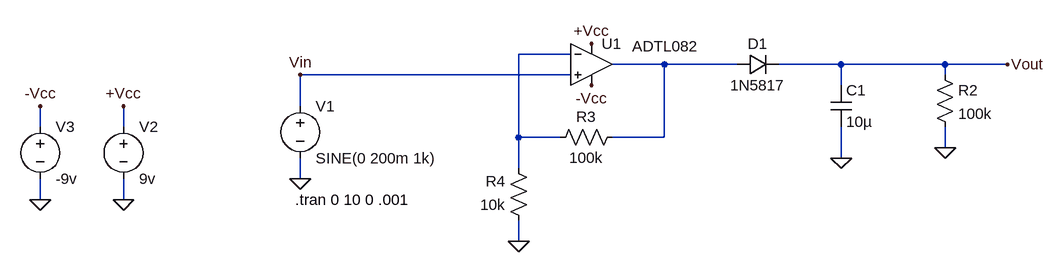
[diagram p0: schematic AudioToArduino.asc]
AudioToArduino.asc, the LTspice schematic file:
Version 4.1
SHEET 1 880 680
WIRE -48 64 -128 64
WIRE 96 80 16 80
WIRE 208 80 96 80
WIRE 368 80 272 80
WIRE 528 80 368 80
WIRE 624 80 528 80
WIRE -48 96 -464 96
WIRE 528 96 528 80
WIRE 368 112 368 80
WIRE -464 144 -464 96
WIRE -864 176 -864 144
WIRE -736 176 -736 144
WIRE -128 192 -128 64
WIRE -64 192 -128 192
WIRE 96 192 96 80
WIRE 96 192 16 192
WIRE 528 208 528 176
WIRE 368 224 368 176
WIRE -128 240 -128 192
WIRE -464 256 -464 224
WIRE -864 288 -864 256
WIRE -736 288 -736 256
WIRE -128 352 -128 320
FLAG -464 256 0
FLAG 528 208 0
FLAG 624 80 Vout
FLAG -464 96 Vin
FLAG 368 224 0
FLAG -128 352 0
FLAG -736 288 0
FLAG -864 288 0
FLAG -736 144 +Vcc
FLAG -864 144 -Vcc
FLAG -16 48 +Vcc
FLAG -16 112 -Vcc
SYMBOL voltage -464 128 R0
WINDOW 123 0 0 Left 0
WINDOW 39 0 0 Left 0
SYMATTR InstName V1
SYMATTR Value SINE(0 200m 1k)
SYMBOL cap 352 112 R0
SYMATTR InstName C1
SYMATTR Value 10µ
SYMBOL res 512 80 R0
SYMATTR InstName R2
SYMATTR Value 100k
SYMBOL diode 208 96 R270
WINDOW 0 32 32 VTop 2
WINDOW 3 0 32 VBottom 2
SYMATTR InstName D1
SYMATTR Value 1N5817
SYMATTR Description Diode
SYMATTR Type diode
SYMBOL OpAmps\\ADTL082 -16 16 R0
WINDOW 3 63 36 Left 2
SYMATTR InstName U1
SYMBOL res 32 176 R90
WINDOW 0 0 56 VBottom 2
WINDOW 3 32 56 VTop 2
SYMATTR InstName R3
SYMATTR Value 100k
SYMBOL res -112 336 R180
WINDOW 0 36 76 Left 2
WINDOW 3 36 40 Left 2
SYMATTR InstName R4
SYMATTR Value 10k
SYMBOL voltage -736 160 R0
WINDOW 123 0 0 Left 0
WINDOW 39 0 0 Left 0
SYMATTR InstName V2
SYMATTR Value 9v
SYMBOL voltage -864 160 R0
WINDOW 123 0 0 Left 0
WINDOW 39 0 0 Left 0
SYMATTR InstName V3
SYMATTR Value -9v
TEXT -472 288 Left 2 !.tran 0 10 0 .001

The netlist it stands for:
* AudioToArduino.asc
V1 Vin 0 SINE(0 200m 1k)
C1 Vout 0 10µ
R2 Vout 0 100k
D1 N002 Vout 1N5817
X§U1 Vin N001 +Vcc -Vcc N002 ADTL082  ; pins In+ In- V+ V- OUT
R3 N002 N001 100k
R4 0 N001 10k
V2 +Vcc 0 9v
V3 -Vcc 0 -9v
.model D D
.lib standard.dio
.tran 0 10 0 .001
.lib ADI.lib
.backanno
.end